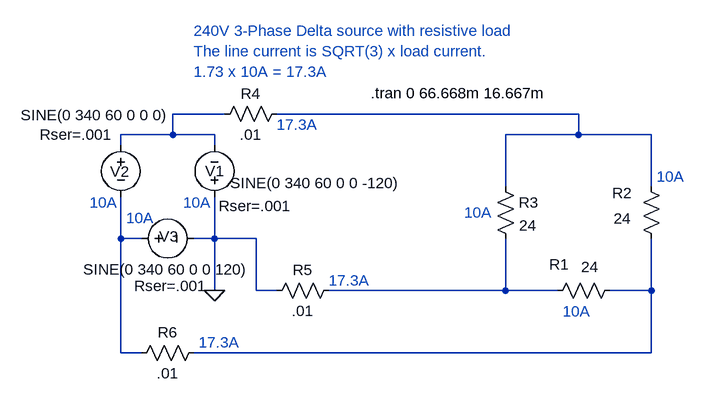
[diagram p0: schematic Delta3Phase.asc]
Delta3Phase.asc, the LTspice schematic file:
Version 4
SHEET 1 880 680
WIRE -336 -176 -416 -176
WIRE 208 -176 -256 -176
WIRE -416 -144 -416 -176
WIRE -416 -144 -496 -144
WIRE -352 -144 -416 -144
WIRE 208 -144 208 -176
WIRE 208 -144 96 -144
WIRE 320 -144 208 -144
WIRE -496 -128 -496 -144
WIRE -352 -128 -352 -144
WIRE 96 -64 96 -144
WIRE 320 -64 320 -144
WIRE -496 16 -496 -48
WIRE -464 16 -496 16
WIRE -352 16 -352 -48
WIRE -352 16 -384 16
WIRE -288 16 -352 16
WIRE -352 96 -352 16
WIRE -288 96 -288 16
WIRE -256 96 -288 96
WIRE 96 96 96 16
WIRE 96 96 -176 96
WIRE 176 96 96 96
WIRE 320 96 320 16
WIRE 320 96 256 96
WIRE -496 192 -496 16
WIRE -464 192 -496 192
WIRE 320 192 320 96
WIRE 320 192 -384 192
FLAG -352 96 0
SYMBOL voltage -496 -144 R0
WINDOW 0 130 56 Left 0
WINDOW 3 -154 -30 Left 0
WINDOW 123 0 0 Left 0
WINDOW 39 -125 0 Left 0
SYMATTR InstName V1
SYMATTR Value SINE(0 340 60 0 0 0)
SYMATTR SpiceLine Rser=.001
SYMBOL voltage -352 -32 R180
WINDOW 0 131 55 Left 0
WINDOW 3 -287 38 Left 0
WINDOW 123 0 0 Left 0
WINDOW 39 -119 2 Left 0
SYMATTR InstName V2
SYMATTR Value SINE(0 340 60 0 0 -120)
SYMATTR SpiceLine Rser=.001
SYMBOL voltage -480 16 R270
WINDOW 0 -12 58 VTop 0
WINDOW 3 -32 53 VBottom 0
WINDOW 123 0 0 Left 0
WINDOW 39 -88 61 VTop 0
SYMATTR InstName V3
SYMATTR Value SINE(0 340 60 0 0 120)
SYMATTR SpiceLine Rser=.001
SYMBOL res 272 80 R90
WINDOW 0 -9 94 VBottom 0
WINDOW 3 -36 46 VTop 0
SYMATTR InstName R1
SYMATTR Value 24
SYMBOL res 304 -80 R0
WINDOW 0 -44 26 Left 0
WINDOW 3 -42 65 Left 0
SYMATTR InstName R2
SYMATTR Value 24
SYMBOL res 80 -80 R0
WINDOW 3 37 76 Left 0
SYMATTR InstName R3
SYMATTR Value 24
SYMBOL res -240 -192 R90
WINDOW 0 0 56 VBottom 0
WINDOW 3 32 56 VTop 0
SYMATTR InstName R4
SYMATTR Value .01
SYMBOL res -160 80 R90
WINDOW 0 0 56 VBottom 0
WINDOW 3 32 56 VTop 0
SYMATTR InstName R5
SYMATTR Value .01
SYMBOL res -368 176 R90
WINDOW 0 0 56 VBottom 0
WINDOW 3 32 56 VTop 0
SYMATTR InstName R6
SYMATTR Value .01
TEXT -112 -208 Left 0 !.tran 0 66.668m 16.667m
TEXT -384 -304 Left 0 ;240V 3-Phase Delta source with resistive load\nThe line current is SQRT(3) x load current.\n1.73 x 10A = 17.3A
TEXT 32 -24 Left 0 ;10A
TEXT 184 128 Left 0 ;10A
TEXT 328 -80 Left 0 ;10A
TEXT -256 -160 Left 0 ;17.3A
TEXT -176 80 Left 0 ;17.3A
TEXT -376 176 Left 0 ;17.3A
TEXT -544 -40 Left 0 ;10A
TEXT -400 -40 Left 0 ;10A
TEXT -488 -16 Left 0 ;10A

The netlist it stands for:
* Delta3Phase.asc
V1 N001 N003 SINE(0 340 60 0 0 0) Rser=.001
V2 0 N001 SINE(0 340 60 0 0 -120) Rser=.001
V3 N003 0 SINE(0 340 60 0 0 120) Rser=.001
R1 N005 N004 24
R2 N002 N005 24
R3 N002 N004 24
R4 N002 N001 .01
R5 N004 0 .01
R6 N005 N003 .01
.tran 0 66.668m 16.667m
* 240V 3-Phase Delta source with resistive load
* The line current is SQRT(3) x load current.
* 1.73 x 10A = 17.3A
* 10A
* 10A
* 10A
* 17.3A
* 17.3A
* 17.3A
* 10A
* 10A
* 10A
.backanno
.end